# Altium schematic sheet ServoConnect.SchDoc
size A; SheetNumber: 3; SheetTotal: 2
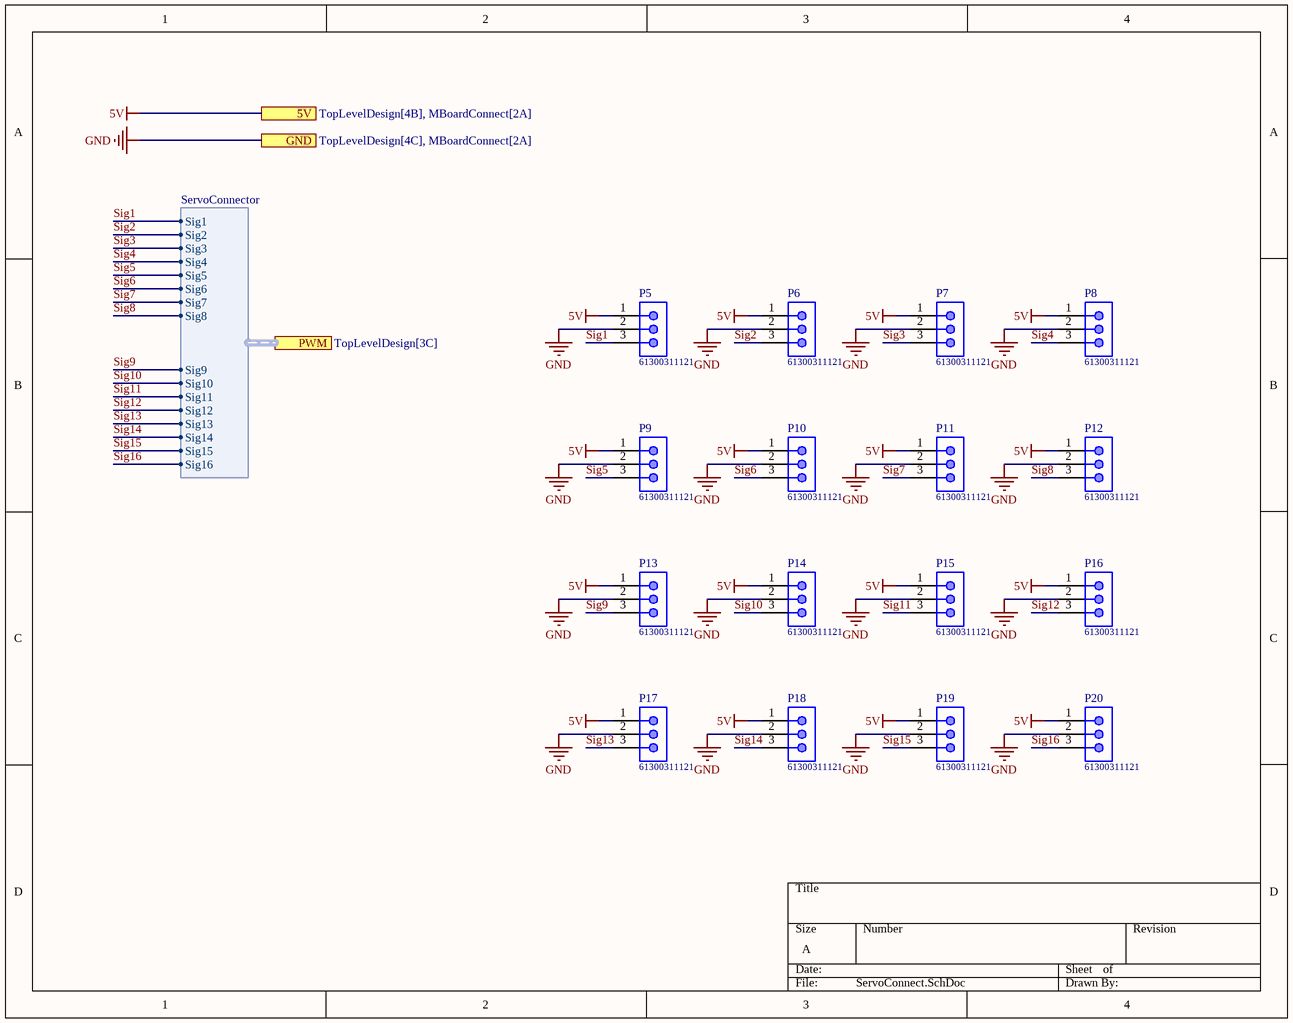
[diagram p0: ServoConnect.SchDoc]

## Parts
P5  61300311121  [61300311121]
P6  61300311121  [61300311121]
P7  61300311121  [61300311121]
P8  61300311121  [61300311121]
P9  61300311121  [61300311121]
P10  61300311121  [61300311121]
P11  61300311121  [61300311121]
P12  61300311121  [61300311121]
P13  61300311121  [61300311121]
P14  61300311121  [61300311121]
P15  61300311121  [61300311121]
P16  61300311121  [61300311121]
P17  61300311121  [61300311121]
P18  61300311121  [61300311121]
P19  61300311121  [61300311121]
P20  61300311121  [61300311121]

## Ports
5V (see TopLevelDesign[4B], MBoardConnect[2A]), GND (see TopLevelDesign[4C], MBoardConnect[2A]), PWM (harness ServoConnector, see TopLevelDesign[3C])

## Harnesses
ServoConnector: Sig1, Sig2, Sig3, Sig4, Sig5, Sig6, Sig7, Sig8, Sig9, Sig10, Sig11, Sig12, Sig13, Sig14, Sig15, Sig16

## Nets
5V: P5.1 P6.1 P7.1 P8.1 P9.1 P10.1 P11.1 P12.1 P13.1 P14.1 P15.1 P16.1 P17.1 P18.1 P19.1 P20.1 ; port 5V
GND: P5.2 P6.2 P7.2 P8.2 P9.2 P10.2 P11.2 P12.2 P13.2 P14.2 P15.2 P16.2 P17.2 P18.2 P19.2 P20.2 ; port GND
Sig1: P5.3 ; port PWM.Sig1
Sig2: P6.3 ; port PWM.Sig2
Sig3: P7.3 ; port PWM.Sig3
Sig4: P8.3 ; port PWM.Sig4
Sig5: P9.3 ; port PWM.Sig5
Sig6: P10.3 ; port PWM.Sig6
Sig7: P11.3 ; port PWM.Sig7
Sig8: P12.3 ; port PWM.Sig8
Sig9: P13.3 ; port PWM.Sig9
Sig10: P14.3 ; port PWM.Sig10
Sig11: P15.3 ; port PWM.Sig11
Sig12: P16.3 ; port PWM.Sig12
Sig13: P17.3 ; port PWM.Sig13
Sig14: P18.3 ; port PWM.Sig14
Sig15: P19.3 ; port PWM.Sig15
Sig16: P20.3 ; port PWM.Sig16

## Library data of the parts
P5-P20 = CMP-002-00470-1: WR-PHD Pin Header, THT, pitch 2.54mm, Single Row, Vertical, 3p; Manufacturer: Wurth Elektronik; Withstanding Voltage: 500VAC; Supply name 1: Mouser; Working Voltage: 250VAC; Contact Resistance: 20mOhm; Rated Current: 3A; Pin Number: 3; Source: WR-PHD_Pin Header_2.54mm.SchLib; Mounting Technology: THT; Design Item ID: 61300311121; Packaging: Bag; Supplier 2 Name: Digi-Key; ComponentLink1Description: Manufacturer; Published Date: May 2020; Supplier 3 URL: N/A; ComponentLink2Description: Datasheet; Supplier 3 SN: N/A; Supplier 2 SN: N/A; Operating Temperature: -40 to +105degC; Manufacturer Part Number: 61300311121; ComponentLink3Description: Global Supply; Gender: Pin Header; Supplier 2 URL: N/A; ComponentLink1URL: http://www.we-online.de; Supplier 1 SN: 710-61300311121; Supplier 1 Name: Mouser; ComponentLink3URL: https://www.mouser.vn/ProductDetail/Wurth-Elektronik/61300311121?qs=PhR8RmCirEYxRWFJzNKsUw%3D%3D; Supplier 3 Name: thegioiic; Row Number: Single; Pins: 3; ComponentLink2URL: https://www.we-online.com/catalog/datasheet/61300311121.pdf; Supplier 1 URL: https://www.mouser.vn/ProductDetail/Wurth-Elektronik/61300311121?qs=PhR8RmCirEYxRWFJzNKsUw%3D%3D; Orientation: Vertical; Pitch: 2.54mm; Component Type: Standard